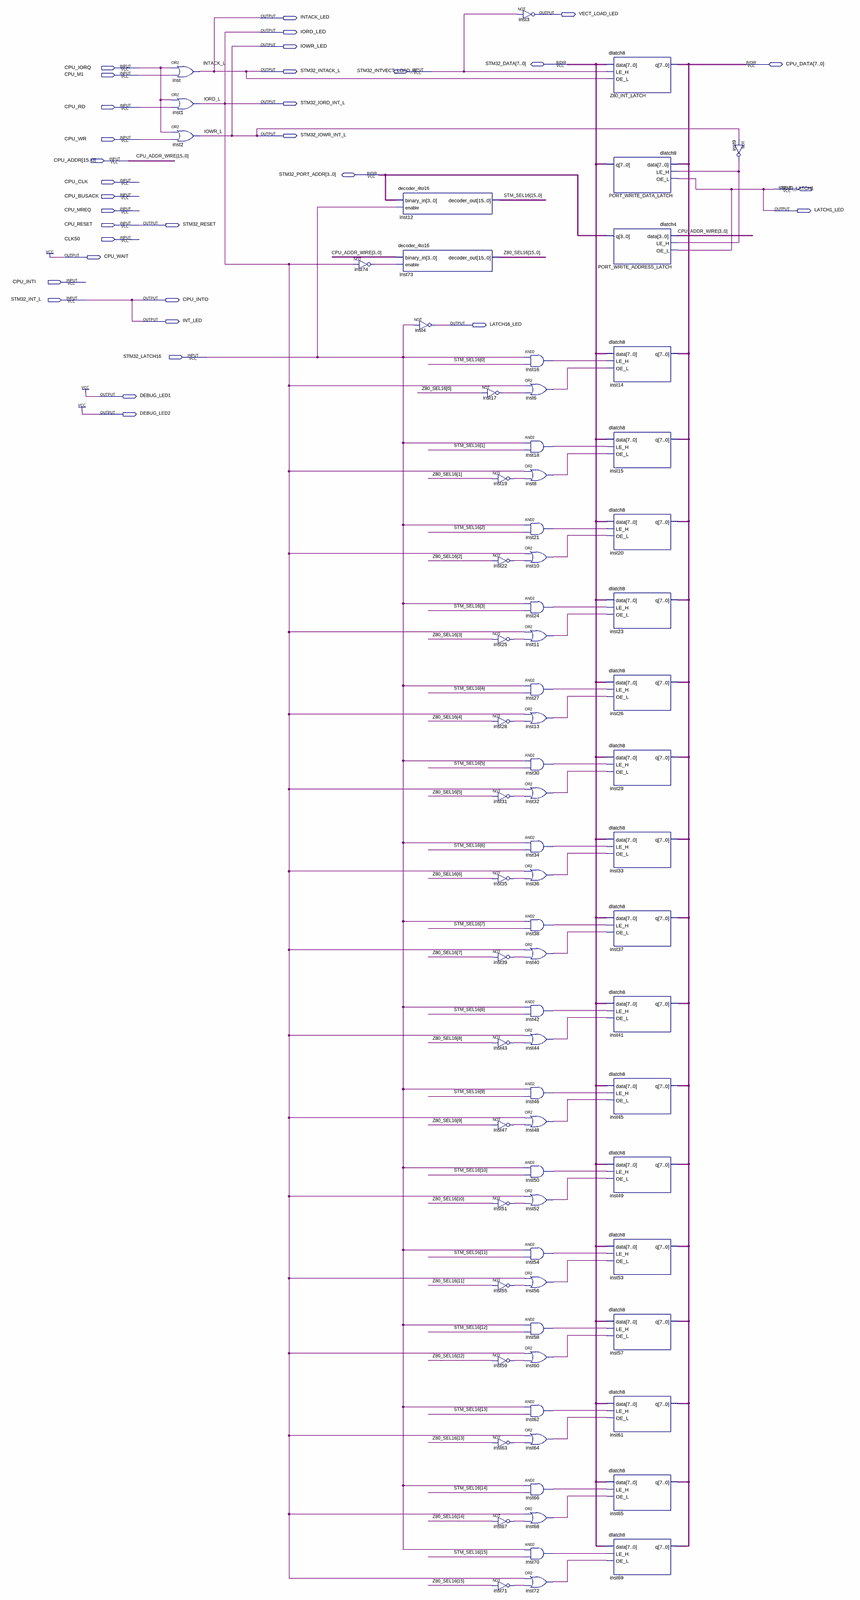
[diagram p0: schematic sheet, whole]
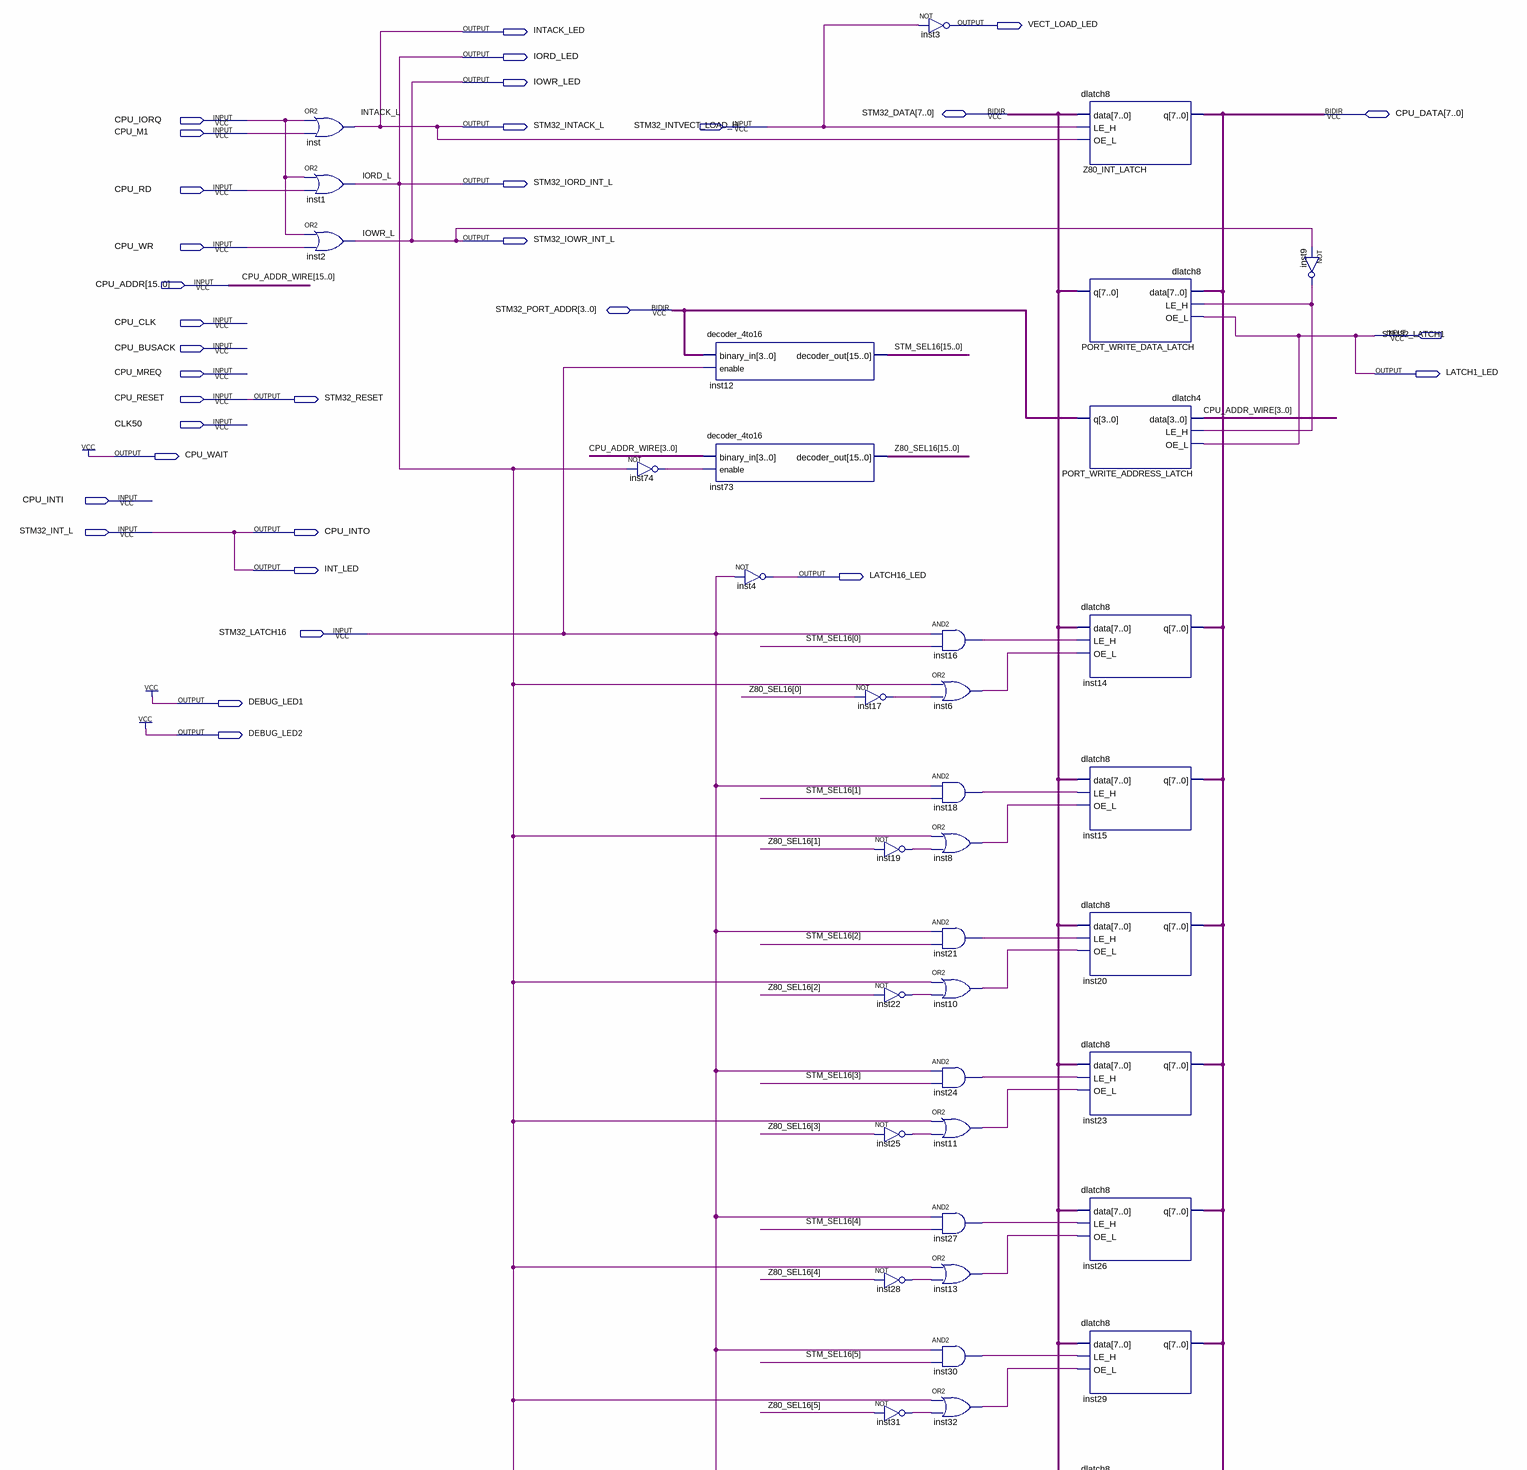
[diagram p1: schematic sheet, upper part]
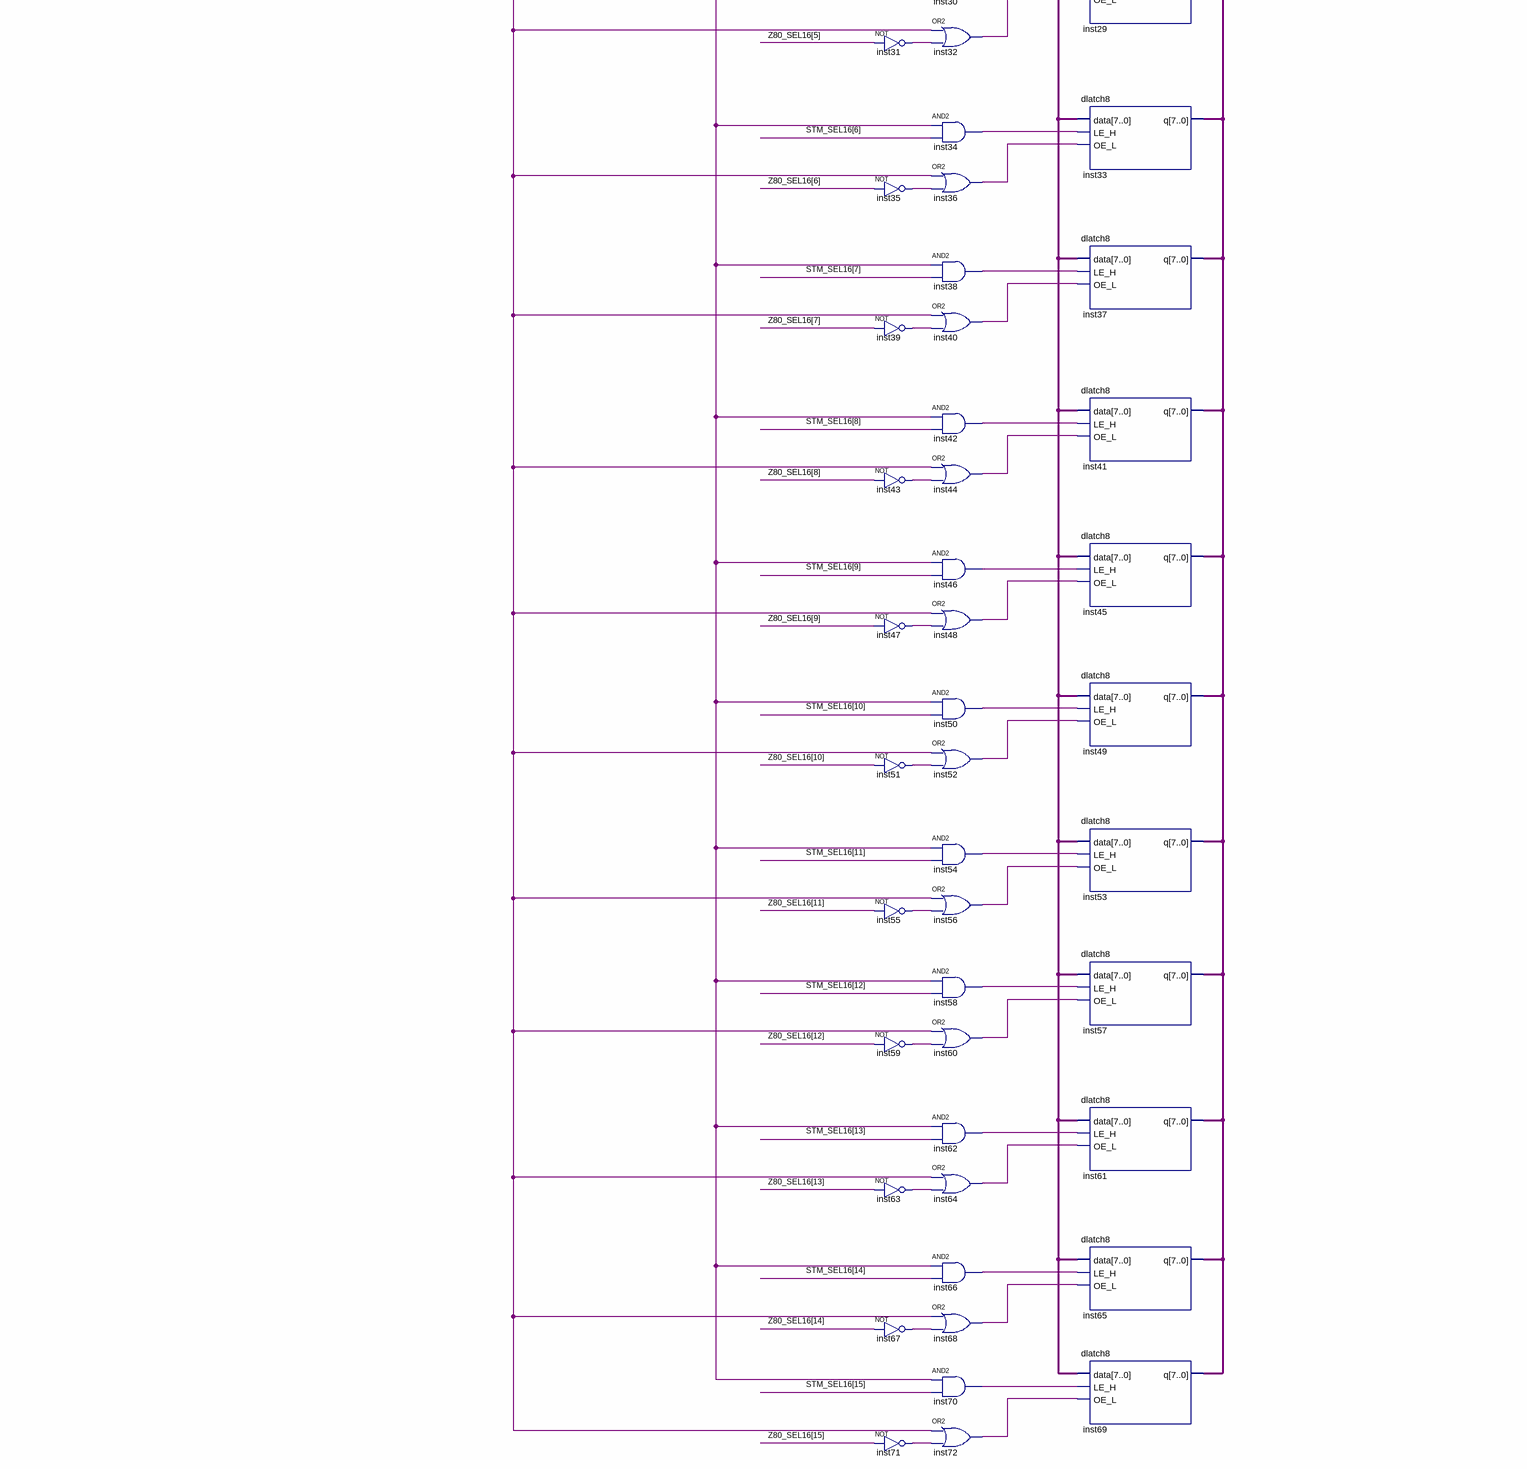
[diagram p2: schematic sheet, lower part]
// Quartus schematic fapio.bdf as structural Verilog: 76 symbols, 33 pins
module fapio (
  input  CPU_IORQ,
  input  STM32_INTVECT_LOAD_H,
  input  CPU_M1,
  input  CPU_RD,
  input  CPU_WR,
  input  [15:0] CPU_ADDR,
  input  CPU_CLK,
  input  STM32_LATCH1,
  input  CPU_BUSACK,
  input  CPU_MREQ,
  input  CPU_RESET,
  input  CLK50,
  input  CPU_INTI,
  input  STM32_INT_L,
  input  STM32_LATCH16,
  inout  [7:0] STM32_DATA,
  inout  [7:0] CPU_DATA,
  inout  [3:0] STM32_PORT_ADDR,
  output VECT_LOAD_LED,
  output INTACK_LED,
  output IORD_LED,
  output IOWR_LED,
  output STM32_INTACK_L,
  output STM32_IORD_INT_L,
  output STM32_IOWR_INT_L,
  output LATCH1_LED,
  output STM32_RESET,
  output CPU_WAIT,
  output CPU_INTO,
  output INT_LED,
  output LATCH16_LED,
  output DEBUG_LED1,
  output DEBUG_LED2
);

  wire inst6_out, inst8_out, inst9_out, inst10_out, inst11_out, inst13_out, inst16_out, inst17_out,
       inst18_out, inst19_out, inst21_out, inst22_out, inst24_out, inst25_out, inst27_out, inst28_out,
       inst30_out, inst31_out, inst32_out, inst34_out, inst35_out, inst36_out, inst38_out, inst39_out,
       inst40_out, inst42_out, inst43_out, inst44_out, inst46_out, inst47_out, inst48_out, inst50_out,
       inst51_out, inst52_out, inst54_out, inst55_out, inst56_out, inst58_out, inst59_out, inst60_out,
       inst62_out, inst63_out, inst64_out, inst66_out, inst67_out, inst68_out, inst70_out, inst71_out,
       inst72_out, inst74_out;
  wire [15:0] STM_SEL16, Z80_SEL16;

  or inst (INTACK_LED, CPU_IORQ, CPU_M1);
  or inst1 (IORD_LED, CPU_IORQ, CPU_RD);
  or inst2 (IOWR_LED, CPU_IORQ, CPU_WR);
  not inst74 (inst74_out, IORD_LED);
  decoder_4to16 inst12 (.binary_in(STM32_PORT_ADDR), .enable(STM32_LATCH16), .decoder_out(STM_SEL16));
  decoder_4to16 inst73 (.binary_in(CPU_ADDR[3:0]), .enable(inst74_out), .decoder_out(Z80_SEL16));
  not inst4 (LATCH16_LED, STM32_LATCH16);
  not inst17 (inst17_out, Z80_SEL16[0]);
  not inst19 (inst19_out, Z80_SEL16[1]);
  not inst22 (inst22_out, Z80_SEL16[2]);
  not inst25 (inst25_out, Z80_SEL16[3]);
  not inst28 (inst28_out, Z80_SEL16[4]);
  not inst31 (inst31_out, Z80_SEL16[5]);
  not inst35 (inst35_out, Z80_SEL16[6]);
  not inst39 (inst39_out, Z80_SEL16[7]);
  not inst43 (inst43_out, Z80_SEL16[8]);
  not inst47 (inst47_out, Z80_SEL16[9]);
  not inst51 (inst51_out, Z80_SEL16[10]);
  not inst55 (inst55_out, Z80_SEL16[11]);
  not inst59 (inst59_out, Z80_SEL16[12]);
  not inst63 (inst63_out, Z80_SEL16[13]);
  not inst67 (inst67_out, Z80_SEL16[14]);
  not inst71 (inst71_out, Z80_SEL16[15]);
  not inst3 (VECT_LOAD_LED, STM32_INTVECT_LOAD_H);
  and inst16 (inst16_out, STM32_LATCH16, STM_SEL16[0]);
  or inst6 (inst6_out, IORD_LED, inst17_out);
  and inst18 (inst18_out, STM32_LATCH16, STM_SEL16[1]);
  or inst8 (inst8_out, IORD_LED, inst19_out);
  and inst21 (inst21_out, STM32_LATCH16, STM_SEL16[2]);
  or inst10 (inst10_out, IORD_LED, inst22_out);
  and inst24 (inst24_out, STM32_LATCH16, STM_SEL16[3]);
  or inst11 (inst11_out, IORD_LED, inst25_out);
  and inst27 (inst27_out, STM32_LATCH16, STM_SEL16[4]);
  or inst13 (inst13_out, IORD_LED, inst28_out);
  and inst30 (inst30_out, STM32_LATCH16, STM_SEL16[5]);
  or inst32 (inst32_out, IORD_LED, inst31_out);
  and inst34 (inst34_out, STM32_LATCH16, STM_SEL16[6]);
  or inst36 (inst36_out, IORD_LED, inst35_out);
  and inst38 (inst38_out, STM32_LATCH16, STM_SEL16[7]);
  or inst40 (inst40_out, IORD_LED, inst39_out);
  and inst42 (inst42_out, STM32_LATCH16, STM_SEL16[8]);
  or inst44 (inst44_out, IORD_LED, inst43_out);
  and inst46 (inst46_out, STM32_LATCH16, STM_SEL16[9]);
  or inst48 (inst48_out, IORD_LED, inst47_out);
  and inst50 (inst50_out, STM32_LATCH16, STM_SEL16[10]);
  or inst52 (inst52_out, IORD_LED, inst51_out);
  and inst54 (inst54_out, STM32_LATCH16, STM_SEL16[11]);
  or inst56 (inst56_out, IORD_LED, inst55_out);
  and inst58 (inst58_out, STM32_LATCH16, STM_SEL16[12]);
  or inst60 (inst60_out, IORD_LED, inst59_out);
  and inst62 (inst62_out, STM32_LATCH16, STM_SEL16[13]);
  or inst64 (inst64_out, IORD_LED, inst63_out);
  and inst66 (inst66_out, STM32_LATCH16, STM_SEL16[14]);
  or inst68 (inst68_out, IORD_LED, inst67_out);
  and inst70 (inst70_out, STM32_LATCH16, STM_SEL16[15]);
  or inst72 (inst72_out, IORD_LED, inst71_out);
  dlatch8 Z80_INT_LATCH (.data(STM32_DATA), .LE_H(STM32_INTVECT_LOAD_H), .OE_L(INTACK_LED), .q(CPU_DATA));
  dlatch8 PORT_WRITE_DATA_LATCH (.data(CPU_DATA), .LE_H(inst9_out), .OE_L(STM32_LATCH1), .q(STM32_DATA));
  dlatch4 PORT_WRITE_ADDRESS_LATCH (.data(CPU_ADDR[3:0]), .LE_H(inst9_out), .OE_L(STM32_LATCH1), .q(STM32_PORT_ADDR));
  dlatch8 inst14 (.data(STM32_DATA), .LE_H(inst16_out), .OE_L(inst6_out), .q(CPU_DATA));
  dlatch8 inst15 (.data(STM32_DATA), .LE_H(inst18_out), .OE_L(inst8_out), .q(CPU_DATA));
  dlatch8 inst20 (.data(STM32_DATA), .LE_H(inst21_out), .OE_L(inst10_out), .q(CPU_DATA));
  dlatch8 inst23 (.data(STM32_DATA), .LE_H(inst24_out), .OE_L(inst11_out), .q(CPU_DATA));
  dlatch8 inst26 (.data(STM32_DATA), .LE_H(inst27_out), .OE_L(inst13_out), .q(CPU_DATA));
  dlatch8 inst29 (.data(STM32_DATA), .LE_H(inst30_out), .OE_L(inst32_out), .q(CPU_DATA));
  dlatch8 inst33 (.data(STM32_DATA), .LE_H(inst34_out), .OE_L(inst36_out), .q(CPU_DATA));
  dlatch8 inst37 (.data(STM32_DATA), .LE_H(inst38_out), .OE_L(inst40_out), .q(CPU_DATA));
  dlatch8 inst41 (.data(STM32_DATA), .LE_H(inst42_out), .OE_L(inst44_out), .q(CPU_DATA));
  dlatch8 inst45 (.data(STM32_DATA), .LE_H(inst46_out), .OE_L(inst48_out), .q(CPU_DATA));
  dlatch8 inst49 (.data(STM32_DATA), .LE_H(inst50_out), .OE_L(inst52_out), .q(CPU_DATA));
  dlatch8 inst53 (.data(STM32_DATA), .LE_H(inst54_out), .OE_L(inst56_out), .q(CPU_DATA));
  dlatch8 inst57 (.data(STM32_DATA), .LE_H(inst58_out), .OE_L(inst60_out), .q(CPU_DATA));
  dlatch8 inst61 (.data(STM32_DATA), .LE_H(inst62_out), .OE_L(inst64_out), .q(CPU_DATA));
  dlatch8 inst65 (.data(STM32_DATA), .LE_H(inst66_out), .OE_L(inst68_out), .q(CPU_DATA));
  dlatch8 inst69 (.data(STM32_DATA), .LE_H(inst70_out), .OE_L(inst72_out), .q(CPU_DATA));
  not inst9 (inst9_out, IOWR_LED);

  assign CPU_INTO = STM32_INT_L;
  assign CPU_WAIT = 1'b1;
  assign DEBUG_LED1 = 1'b1;
  assign DEBUG_LED2 = 1'b1;
  assign INT_LED = STM32_INT_L;
  assign LATCH1_LED = STM32_LATCH1;
  assign STM32_INTACK_L = INTACK_LED;
  assign STM32_IORD_INT_L = IORD_LED;
  assign STM32_IOWR_INT_L = IOWR_LED;
  assign STM32_RESET = CPU_RESET;

  // Other names for the same wires on the sheet: CPU_ADDR_WIRE[15:0] = CPU_ADDR; INTACK_L = INTACK_LED;
  //   IORD_L = IORD_LED; IOWR_L = IOWR_LED
endmodule
